# Altium schematic sheet Experiment 1.SchDoc
size A4; Organization: Altium Limited; Address1: L3, 12a Rodborough Rd; Address2: Frenchs Forest; Address3: NSW; Address4: Australia 2086; DocumentNumber: 1; SheetNumber: 1; SheetTotal: 3
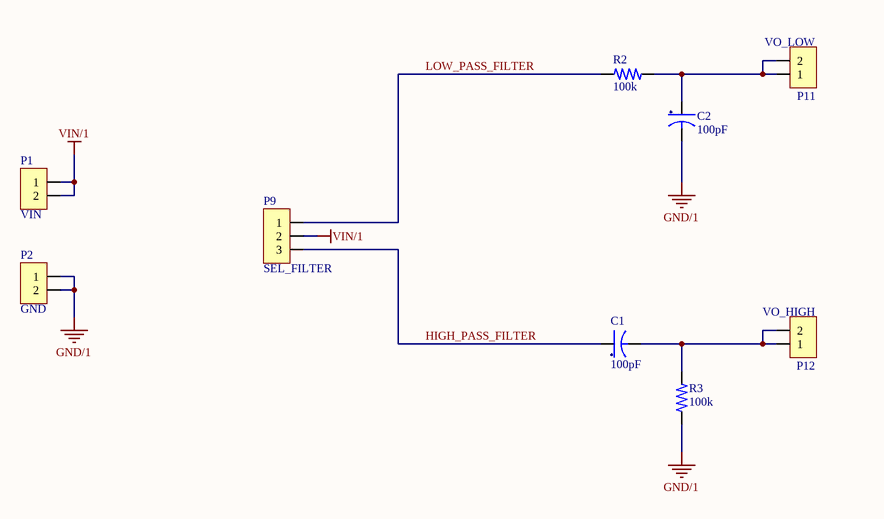
[diagram p0: Experiment 1.SchDoc]

## Parts
C1  100pF  [C0805]
C2  100pF  [C0805]
P1  VIN  [PINHD-1X02 ONCE]  (net tie, no BOM)
P2  GND  [PINHD-1X02 ONCE]  (net tie, no BOM)
P9  SEL_FILTER  [PINHD-1X03]
P11  VO_LOW  [PINHD-1X02 ONCE]  (net tie, no BOM)
P12  VO_HIGH  [PINHD-1X02 ONCE]  (net tie, no BOM)
R2  100k  [R0805]
R3  100k  [R0805]

## Nets
GND/1: C2.2 P2.1 P2.2 R3.1
VIN/1: P1.1 P1.2 P9.2
HIGH_PASS_FILTER: C1.1 P9.3
LOW_PASS_FILTER: P9.1 R2.1
NetC1_2: C1.2 P12.1 P12.2 R3.2
NetC2_1: C2.1 P11.1 P11.2 R2.2

## Notes on the sheet
- Elivelton Santos
- https://github.com/eliveltonpsantos
- Project:
- Sheet:
- Date:
- Time:
- Sheet
- of
- File:

## Library data of the parts
C1 C2 = CC0805JRNPO9BN101: CAP CER 100PF 50V NPO 0805; Manufacturer: Yageo; Tolerance: ±5%; Category: Capacitors; Manufacturer Part Number: CC0805JRNPO9BN101; Package / Case: 0805 (2012 Metric); Capacitance: 100pF; Voltage: 50V; Supplier 1: Digi-Key; Supplier Part Number 1: 311-1111-1-ND
P1 P2 P11 P12 = PIN HEADER 1X02 ONCE: CONN HEADER 2POS .100" STR TIN; Manufacturer: Molex, LLC; Manufacturer Part Number: 0901200122; Category: Connectors; Supplier 1: Digi-Key; Supplier Part Number 1: WM8072-ND
P9 = PIN HEADER 1X03: CONN HEADER 3POS .100" STR TIN; Manufacturer: Molex, LLC; Manufacturer Part Number: 0901200123; Category: Connectors; Supplier 1: Digi-Key; Supplier Part Number 1: WM8073-ND
R2 R3 = ERJ-6ENF1003V: RES SMD 100K OHM 1% 1/8W 0805; Manufacturer: Panasonic Electronic Components; Power (Watts): 0.125W, 1/8W; Category: Resistors; Manufacturer Part Number: ERJ-6ENF1003V; Package / Case: 0805 (2012 Metric); Resistance (Ohms): 100k; Tolerance: ±1%; Supplier 1: Digi-Key; Supplier Part Number 1: P100KCCT-ND